# EAGLE design untitled (EAGLE 6.1)
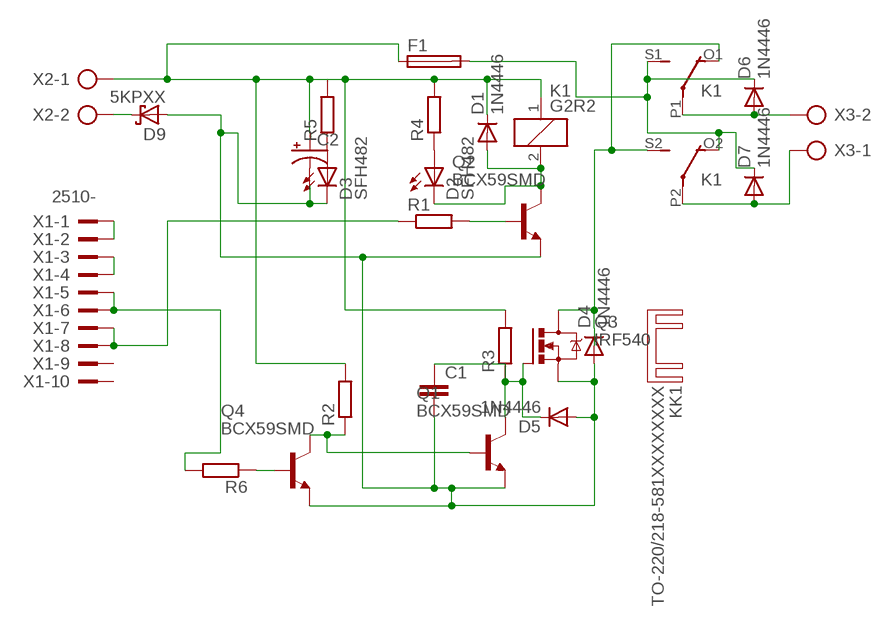
[diagram p0: schematic, sheet 1]

## Parts
C1  C5/3  [C5B3]
C2  CPOL-USE7.5-16  [E7,5-16]
D1  1N4446  [DO35-10]
D2  SFH482  [SFH482]
D3  SFH482  [SFH482]
D4  1N4446  [DO35-10]
D5  1N4446  [DO35-10]
D6  1N4446  [DO35-10]
D7  1N4446  [DO35-10]
D9  5KPXX  [P6T15]
F1  SH22,5  [SH22,5]
K1  G2R2  [G2R2]
KK1  TO-220/218-581XXXXXXXX  [581XXXXXXXX]
Q1  BCX59SMD  [TO92-EBC]
Q2  BCX59SMD  [TO92-EBC]
Q3  IRF540  [TO220BV]
Q4  BCX59SMD  [TO92-EBC]
R1  R-EU_0207/10  [0207/10]
R2  R-EU_0207/10  [0207/10]
R3  R-EU_0207/10  [0207/10]
R4  R-EU_0207/10  [0207/10]
R5  R-EU_0207/10  [0207/10]
R6  R-EU_0207/10  [0207/10]
X1  2510-  [PAK100/2500-10]
X2  AK300/2  [AK300/2]
X3  AK300/2  [AK300/2]

## Nets
N$1: X1.1 X1.2
N$2: X1.3 X1.4
N$3: R6.2 X1.5 X1.6
N$4: R1.1 X1.7 X1.8
N$5: D1.A D2.K(C) K1.2 Q2.C
N$6: Q1.B Q4.C R2.1
N$7: C1.2 C2.- D3.K(C) D4.A D5.A D9.A Q1.E Q2.E Q3.S Q4.E
N$8: C2.+ D1.C F1.1 K1.1 R2.2 R3.2 R4.2 R5.2 X2.1
N$9: C1.1 D5.C Q1.C Q3.G R3.1
N$11: Q2.B R1.2
N$12: D3.A R5.1
N$13: D6.A K1.P1(2:P) X3.2
N$14: D7.A K1.P2(3:P) X3.1
N$15: D9.C X2.2
N$16: D6.C D7.C F1.2 K1.O2(3:O) K1.S1(2:S)
N$17: D2.A R4.1
N$19: D4.C K1.O1(2:O) K1.S2(3:S) Q3.D
N$21: Q4.B R6.1
Unconnected: X1.9 X1.10

## Library data of the parts
C1 = capacitor-wima:C: CAPACITOR naming: grid - package width
C2 = rcl:CPOL-US: POLARIZED CAPACITOR, American symbol
D1 D4-D7 = diode:1N4446: DIODE high speed (Philips)
D2 D3 = led:SFH482: IR LED infrared emitting diode, Infineon
D9 = diode:5KPXX: DIODE transient voltage suppressor
F1 = fuse:SH22,5: FUSE HOLDER grid 22,5 mm, OGN0031 8201, Schurter (Buerklin); MF: SCHURTER; MPN: 0031.8201; OC_FARNELL: 1162740; OC_NEWARK: 96F8317
K1 = relay:G2R2: RELAY 2 x switch, Omron; MF: OMRON COMPONENTS USA; MPN: G2R-2-DC6; OC_FARNELL: unknown; OC_NEWARK: 89C5317
KK1 = heatsink-aavid:TO-220/218: HEATSINKS TO-220/218
Q1 Q2 Q4 = transistor-npn:BCX59*: NPN Transistor
Q3 = transistor-power:IRF540: HEXFET Power MOSFET
R1-R6 = rcl:R-EU_: RESISTOR, European symbol
X1 = con-3m:2510-: 3M (TM) Pak 100 4-Wall Header Source: 3M; MF: 3M; MPN: 2510-6002UB; OC_FARNELL: 9838244; OC_NEWARK: 46F4725
X2 X3 = con-ptr500:AK300/2: CONNECTOR; OC_FARNELL: unknown; OC_NEWARK: unknown

## Board
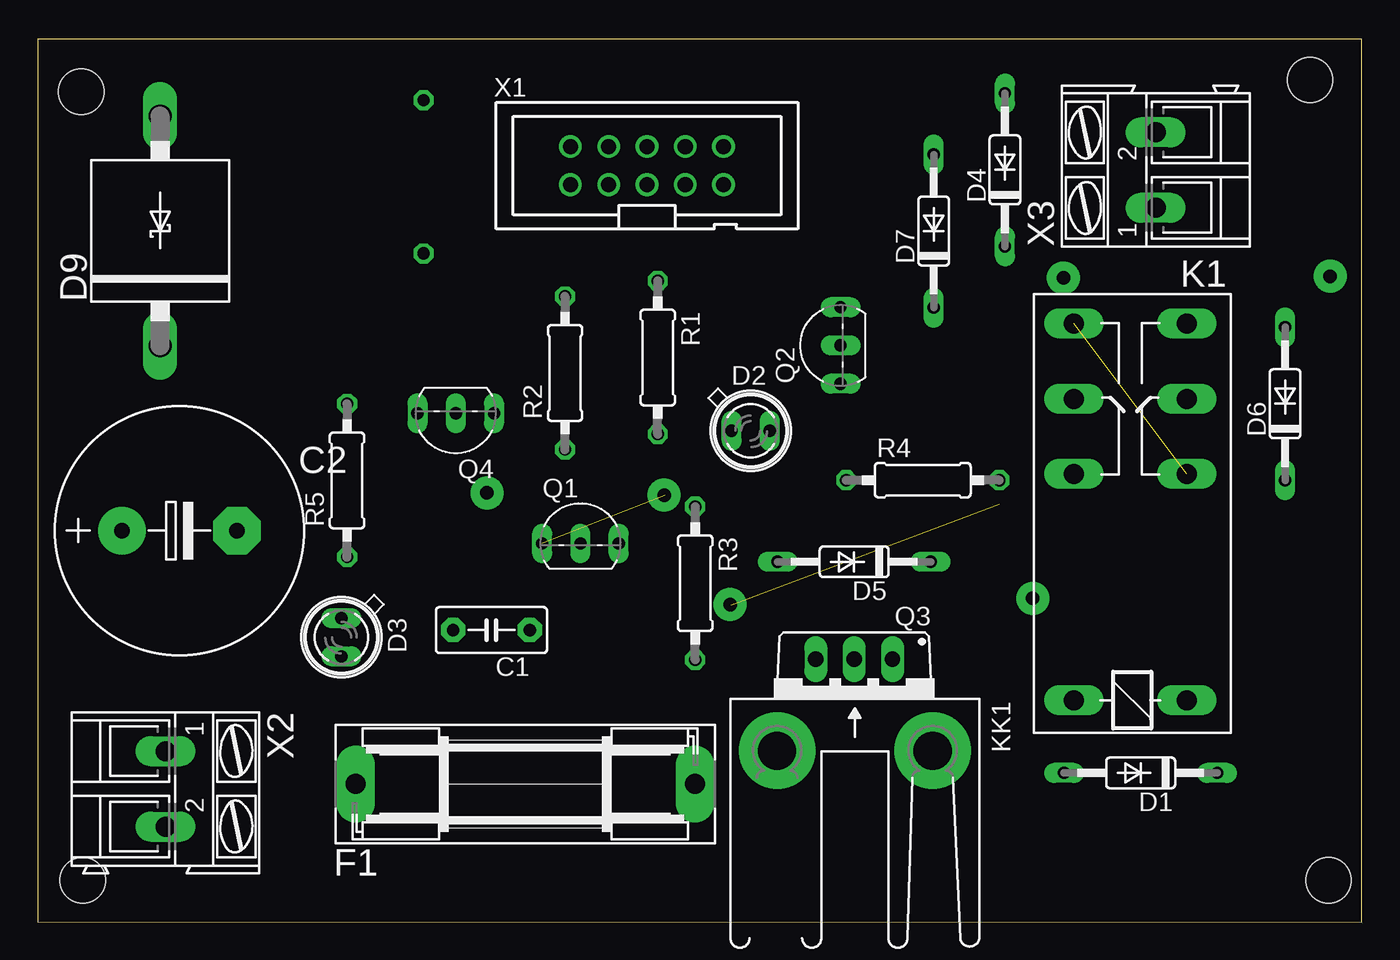
[diagram p1: board, top side]
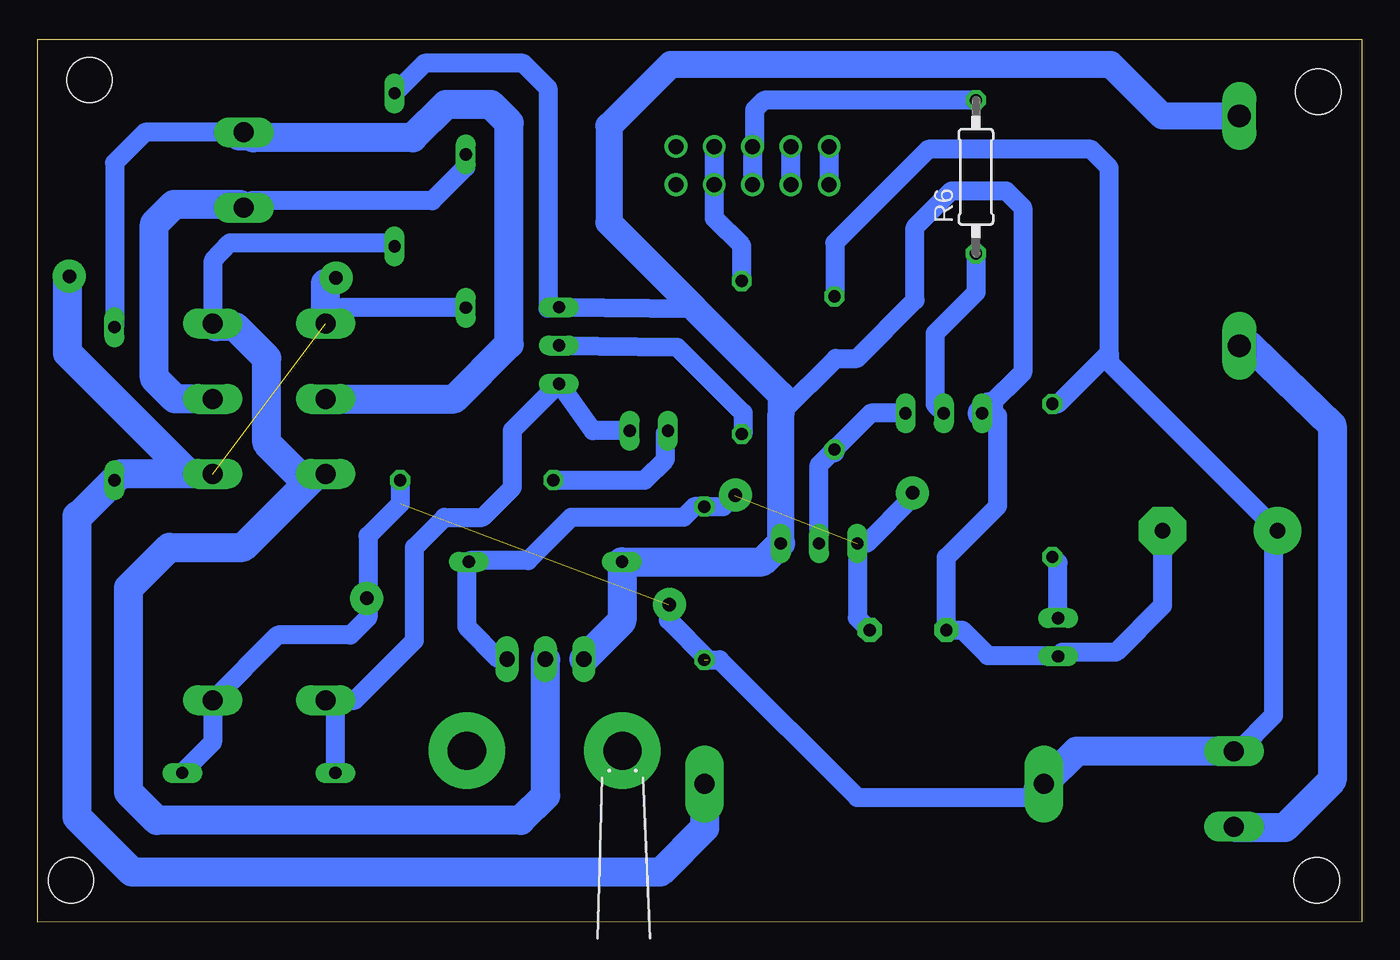
[diagram p2: board, bottom side, seen from below]

Size 87.81 x 58.56 mm. Coordinates in mm from the lower left corner, seen from the top.
Outline: 0,0.02 87.81,0 87.81,58.55 0.01,58.56 0,0.02
Copper layers (1*16): Top 0.035mm / dielectric 1.5mm / Bottom 0.035mm
Design rules: minimum track width 10mil, minimum drill 24mil, track to track 8mil, track to pad 8mil, pad to pad 8mil, via to via 8mil, smd to smd 8mil, copper to edge 40mil, drill to drill 8mil, minimum pad ring 10mil, minimum via ring 8mil, stop-mask expansion 4mil, vias tented up to drill 0mil, thermal gap 10mil
Holes 3 mm at 2.88,55.08 84.38,55.86 2.99,2.79 85.6,2.79

### Footprints (pad centres in the part's own frame; a part is rotated, then mirrored left to right if it is on the bottom)
C5B3 = drill 0.813 pad 1.6 octagon: 1 -2.54,0; 2 2.54,0
E7,5-16 = drill 1.016 pad 3.15: + -3.81,0 | drill 1.016 pad 3.15 octagon: - 3.81,0
DO35-10 = drill 0.813 long: A 5.08,0; C -5.08,0
SFH482 = drill 0.813 long: A -1.27,0; K 1.27,0
P6T15 = drill 1.499 long: A 7.62,0; C -7.62,0
SH22,5 = drill 1.321 pad 2.54 long: 1 -11.252,0; 2 11.252,0
G2R2 = drill 1.321 long: 1 -2.54,-3.683; 2 -2.54,3.81; O1 12.471,3.81; O2 12.471,-3.683; P1 17.45,3.81; P2 17.45,-3.683; S1 22.454,3.81; S2 22.454,-3.683
581XXXXXXXX = drill 2.54 pad 5.08: A2,5 -5.16,3.45; B2,5 5.16,3.45
TO92-EBC = drill 0.813 long: B 0,-1.27; C -2.54,-1.27; E 2.54,-1.27
TO220BV = drill 1.016 long: D 0,-2.54; G -2.54,-2.54; S 2.54,-2.54
0207/10 = drill 0.813 octagon: 1 -5.08,0; 2 5.08,0
PAK100/2500-10 = drill 1 pad 1.422: 1 -5.08,-1.27; 2 -5.08,1.27; 3 -2.54,-1.27; 4 -2.54,1.27; 5 0,-1.27; 6 0,1.27; 7 2.54,-1.27; 8 2.54,1.27; 9 5.08,-1.27; 10 5.08,1.27
AK300/2 = drill 1.321 long: 1 -2.515,0; 2 2.489,0

### Placement (x,y rotation side)
C1  30.09,19.38 180 top
C2  9.41,25.97 0 top
D1  73.15,9.9 180 top
D2  47.28,32.6 0 top
D3  20.15,18.9 270 top
D4  64.15,49.9 90 top
D5  54.15,23.9 180 top
D6  82.72,34.39 90 top
D7  59.42,45.84 90 top
D9  8.12,45.85 90 top
F1  32.33,9.17 0 top
K1  72.53,17.26 90 top
KK1  54.19,14.82 180 top
Q1  35.99,26.39 0 top
Q2  51.97,38.26 90 top
Q3  54.15,14.9 180 top
Q4  27.72,32.49 180 top
R1  41.12,37.46 270 top
R2  34.97,36.43 90 top
R3  43.6,22.48 270 top
R4  58.7,29.32 0 top
R5  20.51,29.3 90 top
R6  25.59,49.44 90 bottom
X1  40.41,50.18 0 top
X2  8.48,8.83 270 top
X3  74.15,49.9 90 top

### Tracks (layer width: path | path; a pad name or v marks a point on that pad's centre or on a via)
N$1
  Bottom 1.27: X1.2 X1.1
N$2
  Bottom 1.27: X1.3 X1.4
N$3
  Bottom 1.27: R6.2 39.64,54.52 40.26,53.9 40.26,51.6 X1.6 X1.5
N$4
  Bottom 1.27: R1.1 41.12,44.86 42.95,46.69 X1.7 X1.8
N$5
  Bottom 1.27: D1.A 68.07,14.07 K1.2 66.78,14.72 62.83,18.68 62.83,24.87 60.84,26.85 58.31,26.85 56.32,28.84 56.32,32.64 Q2.C 51,32.6 D2.K
N$6
  Bottom 1.27: Q4.C 32.56,33.76 R2.1 | R2.1 34.97,31.15 | Q1.B 35.99,30.33 R2.1
N$7
  Bottom 1.27: D4.A 62.16,56.97 55.62,56.97 53.97,55.33 53.97,40.73 Q2.E 44.21,40.69 38.5,34.98 | 38.5,25.15 Q1.E | 38.5,33.78 34.88,37.4 33.47,37.4 29.62,41.25 29.62,46.09 27.21,48.51 23.59,48.51 22.49,47.41 22.49,36.46 24.75,34.2 24.14,33.59 24.14,27.62 27.55,24.21 C1.2 26.49,19.38 24.8,17.68 20.2,17.68 D3.K 19.88,17.91 16.31,17.91 13.22,21 C2.-
  Bottom 1.778: 38.5,25.15 38.5,33.78 38.5,34.98 49.93,46.41 49.93,52.8 45.84,56.89 16.64,56.89 13.22,53.47 D9.A
  Bottom 1.93: Q3.S 49.07,19.98 D5.A 39.75,23.9 Q1.E | 24.75,34.2 Q4.E
N$8  (2 unrouted)
  Bottom 1.27: D1.C 76.21,11.92 K1.1 71.89,19.04 67.07,19.04 65.9,20.21 65.9,25.62 63.78,27.75 R4.2 | R5.2 20.16,34.38 16.75,37.78 | 16.75,37.78 16.75,50.05 17.97,51.26 28.76,51.26 34.94,45.07 34.94,41.54 R2.2 | 21.5,8.75 21.98,8.27 33.45,8.27 42.58,17.4 R3.2 | X2.1 8.21,11.34 5.84,13.71 5.84,25.73 C2.+ 16.75,37.13 16.75,37.78 | 45.99,21.06 45.99,20.04 43.34,17.39
  Bottom 1.93: 21.5,8.75 F1.1 18.9,11.34 X2.1
N$9  (1 unrouted)
  Bottom 1.27: Q3.G 57.2,17.44 59.35,19.59 59.35,23.78 D5.C 59.14,23.99 55.29,23.99 52.43,26.85 44.98,26.85 44.26,27.56 R3.1 42.34,27.56 41.61,28.3 | C1.1 33.45,20.2 Q1.C 32.83,25.12 29.79,28.16
N$10  (via drill 0.9 pad 2.18)
  other vias: 45.91,21.08
N$11
  Bottom 1.27: Q2.B 45.4,38.15 41.03,33.77 41.03,32.47 R1.2
N$12
  Bottom 1.27: D3.A 20.15,23.85 R5.1
N$13
  Bottom 1.27: 74.73,52.39 80.69,52.39 82.71,50.38 82.71,39.48 D6.A
  Bottom 1.93: X3.2 74.73,52.39 74.48,52.14 73.63,52.14 73.52,52.03 62.94,52.03 60.73,54.24 57.76,54.24 56.54,53.03 56.54,38.34 60.17,34.71 K1.P1
N$14
  Bottom 1.27: D7.A 59.42,50.08 61.65,47.85 73.69,47.85 X3.1 74.38,47.63
  Bottom 1.93: K1.P2 78.71,34.71 80.08,36.08 80.08,46.31 78.76,47.63 74.38,47.63
N$15
  Bottom 1.93: D9.C 7.4,38.23 1.96,32.95 1.96,9.41 5.1,6.27 8.4,6.27 X2.2
N$16  (1 unrouted)
  Bottom 1.27: 82.3,29.74 D6.C | D7.C 67.67,40.76 K1.S1 | K1.O2 77.81,29.74 | 85.82,42.74 85.71,42.85 | 68.72,42.37 68.13,42.95
  Bottom 1.93: K1.O2 82.3,29.74 | 77.81,29.74 85.82,37.75 85.82,42.74 | K1.S1 68.72,42.37 | F1.2 43.58,6.26 46.51,3.33 81.56,3.33 85.2,6.97 85.2,26.97 85.06,26.97 D6.C
N$17
  Bottom 1.27: R4.1 47.56,29.32 46.18,30.7 46.18,32.43 D2.A
N$19
  Bottom 1.27: 70.56,29.74 69.33,29.74 K1.O1 | 75.98,39.49 K1.S2 | 72.62,37.41 72.62,37.46 74.84,39.69 75.83,39.69 76.16,40.01 76.16,43.9 75.06,45.08 64.31,45.08 D4.C
  Bottom 1.93: 70.56,29.74 72.62,31.79 72.62,37.41 74.7,39.49 75.98,39.49 | 69.33,29.74 74.2,24.87 79.09,24.87 81.78,22.17 81.78,8.63 79.91,6.75 55.77,6.75 54.12,8.4 54.12,17.42 Q3.D
N$21
  Bottom 1.27: R6.1 25.59,41.77 28.3,39.05 28.3,34.35 Q4.B
N$22  (via drill 0.9 pad 2.18)
  other vias: 65.98,21.48
N$23  (via drill 0.9 pad 2.18)
  other vias: 29.79,28.48
N$24  (via drill 0.9 pad 2.18)
  other vias: 41.55,28.33
N$25  (via drill 0.9 pad 2.18)
  other vias: 68.03,42.74
N$26  (via drill 0.9 pad 2.18)
  other vias: 85.71,42.85